# Altium schematic sheet ltk-mw.SchDoc
size A3; Organization: Altium Limited; Address1: L3, 12a Rodborough Rd; Address2: Frenchs Forest; Address3: NSW; Address4: Australia 2086
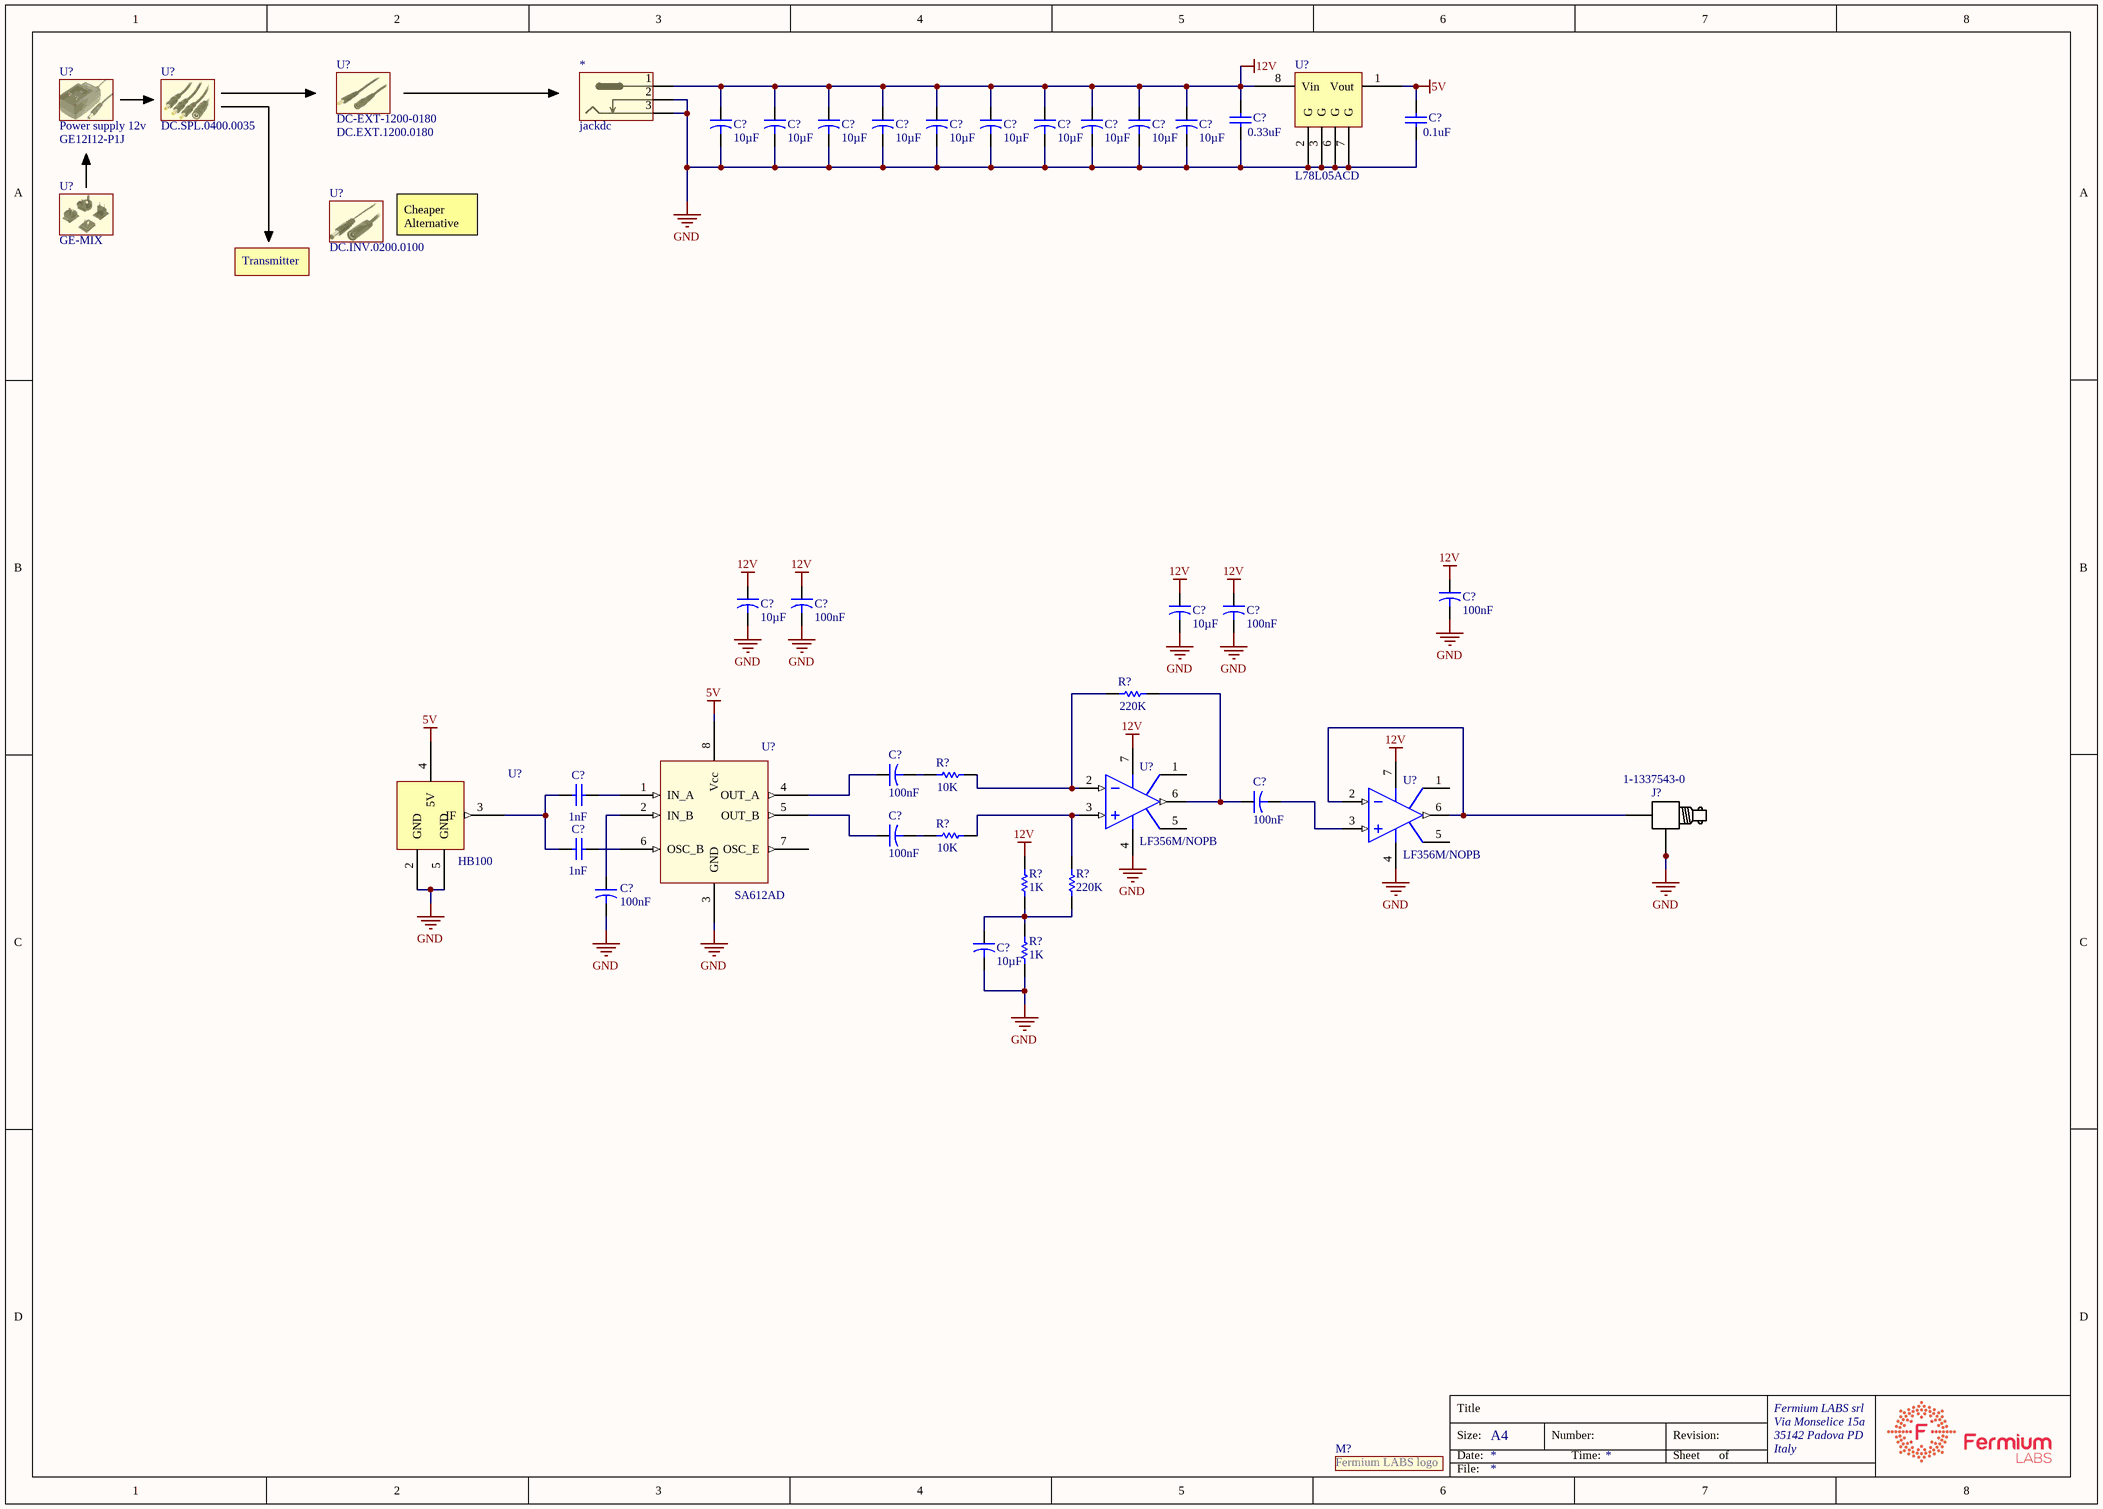
[diagram p0: ltk-mw.SchDoc]

## Parts
(Parts that share a designator on the sheet are numbered #1, #2 ... from top to bottom, then left to right.)
*  jackdc  [dc-jack]
C?#1  Capacitance: 10µF  [CAP 1206/3216]
C?#2  Capacitance: 10µF  [CAP 1206/3216]
C?#3  Capacitance: 10µF  [CAP 1206/3216]
C?#4  Capacitance: 10µF  [CAP 1206/3216]
C?#5  Capacitance: 10µF  [CAP 1206/3216]
C?#6  Capacitance: 10µF  [CAP 1206/3216]
C?#7  Capacitance: 10µF  [CAP 1206/3216]
C?#8  Capacitance: 10µF  [CAP 1206/3216]
C?#9  Capacitance: 10µF  [CAP 1206/3216]
C?#10  Capacitance: 10µF  [CAP 1206/3216]
C?#11  value 0.33uF  [RAD-0.3]
C?#12  value 0.1uF  [RAD-0.3]
C?#13  Capacitance: 100nF  [CAP 0805/2012]
C?#14  Capacitance: 10µF  [CAP 1206/3216]
C?#15  Capacitance: 100nF  [CAP 0805/2012]
C?#16  Capacitance: 10µF  [CAP 1206/3216]
C?#17  Capacitance: 100nF  [CAP 0805/2012]
C?#18  value 1nF  [CAP 0805/2012]
C?#19  Capacitance: 100nF  [CAP 0805/2012]
C?#20  Capacitance: 100nF  [CAP 0805/2012]
C?#21  value 1nF  [CAP 0805/2012]
C?#22  Capacitance: 100nF  [CAP 0805/2012]
C?#23  Capacitance: 100nF  [CAP 0805/2012]
C?#24  Capacitance: 10µF  [CAP 1206/3216]
J?  Supplier Part Number 1: 1-1337543-0  [BNC-RA]
M?  fermiumlabs-logo  [frm-small]  (value not drawn)
R?#1  value 220K  [AXIAL-0.3]  (hidden comment: Res1)
R?#2  value 10K  [AXIAL-0.3]  (hidden comment: Res1)
R?#3  value 10K  [AXIAL-0.3]  (hidden comment: Res1)
R?#4  value 1K  [AXIAL-0.3]  (hidden comment: Res1)
R?#5  value 220K  [AXIAL-0.3]  (hidden comment: Res1)
R?#6  value 1K  [AXIAL-0.3]  (hidden comment: Res1)
U?#1  DC-EXT-1200-0180  Supplier Part Number 1: DC.EXT.1200.0180  (mechanical)
U?#2  Power supply 12v  (mechanical)
U?#3  DC.SPL.0400.0035  (mechanical)
U?#4  L78L05ACD  [ST SOIC-8N]
U?#5  Worldwide plugs for power supply  (value not drawn)  (mechanical)
U?#6  (no value)  (mechanical)
U?#7  Supplier Part Number 3: LF356M/NOPB  [TI SOIC-8 D]  (hidden comment: U*)
U?#8  Supplier Part Number 3: LF356M/NOPB  [TI SOIC-8 D]  (hidden comment: U*)
U?#9  HB100  [HB100]
U?#10  Supplier Part Number 1: SA612AD  [TI SOIC-8 D]  (hidden comment: SA612A)

## Nets
5V: C?#12.2 U?#4.1(Vout) U?#9.4(5V) U?#10.8(Vcc)
12V: *.1 C?#1.1 C?#2.1 C?#3.1 C?#4.1 C?#5.1 C?#6.1 C?#7.1 C?#8.1 C?#9.1 C?#10.1 C?#11.2 C?#13.1 C?#14.1 C?#15.1 C?#16.1 C?#17.1 R?#4.2 U?#4.8(Vin) U?#7.7(VDD+) U?#8.7(VDD+)
GND: *.2 *.3 C?#1.2 C?#2.2 C?#3.2 C?#4.2 C?#5.2 C?#6.2 C?#7.2 C?#8.2 C?#9.2 C?#10.2 C?#11.1 C?#12.1 C?#13.2 C?#14.2 C?#15.2 C?#16.2 C?#17.2 C?#23.2 C?#24.2 J?.2(gnd) J?.A J?.B R?#6.1 U?#4.2(G) U?#4.3(G) U?#4.6(G) U?#4.7(G) U?#7.4(VDD-) U?#8.4(VDD-) U?#9.2(GND) U?#9.5(GND) U?#10.3(GND)
NetC?#18_1: C?#18.1 C?#21.1 U?#9.3(IF)
NetC?#18_2: C?#18.2 U?#10.1(IN_A)
NetC?#19_1: C?#19.1 U?#10.4(OUT_A)
NetC?#19_2: C?#19.2 R?#2.1
NetC?#20_1: C?#20.1 R?#1.2 U?#7.6(OUT)
NetC?#20_2: C?#20.2 U?#8.3(IN+)
NetC?#21_2: C?#21.2 U?#10.6(OSC_B)
NetC?#22_1: C?#22.1 U?#10.5(OUT_B)
NetC?#22_2: C?#22.2 R?#3.1
NetC?#23_1: C?#23.1 U?#10.2(IN_B)
NetC?#24_1: C?#24.1 R?#4.1 R?#5.1 R?#6.2
NetJ?_1: J?.1 U?#8.2(IN-) U?#8.6(OUT)
NetR?#1_1: R?#1.1 R?#2.2 U?#7.2(IN-)
NetR?#3_2: R?#3.2 R?#5.2 U?#7.3(IN+)

Not connected (* = marked no-connect by the designer): U?#7 1(CXA) 5; U?#8 1(CXA) 5; U?#10 7(OSC_E)

## Notes on the sheet
- Cheaper
  Alternative
- (near U?#6) Transmitter
- Title
- Size:
- Date:
- A4
- Number:
- Time:
- Revision:
- Sheet
- of
- Fermium LABS srl
- Via Monselice 15a
- 35142 Padova PD
- Italy
- File:
- (in symbol fermiumlabs-logo) Fermium LABS logo

## Library data of the parts
C?#1-C?#10 C?#14 C?#16 C?#24 = Cap2: Capacitor; Manufacturer: SAMSUNG; Manufacturer Part Number: CL31A106KAHNNNE; Unit: pcs; SuppliedAmount: 0; MinAmount: 100; Capacitor type: ceramic; Capacitor kind: MLCC; Operating voltage: 25V; Dielectric: X5R; Tolerance: ±10%; Case - inch: 1206; Case - mm: 3216; Pads: 2 SMD; Published: 23-Sep-2002; PackageReference: CAPR5-4X5; Publisher: Altium Limited; PackageDescription: 1206; Supplier 1: TME; Supplier Part Number 1: CL31A106KAHNNNE; Category: 1206 MLCC SMD Capacitors; Stock 1: 279700; Pricing 1: 100=0.0248, 300=0.0203, 1000=0.0167, 2000=0.0131, 10000=0.0127 (EUR); Weight: 0.061; Multiples: 100; Mounting: SMD; Operating temperature: -55...85°C; Price Type: NET; ComponentLink1URL: http://static.tme.eu/products_pics/b/e/9/be9e0dd298dcf4979ea1dd3d226e0bfa/58780.jpg; ComponentLink1Description: http://static.tme.eu/products_pics/b/e/9/be9e0dd298dcf4979ea1dd3d226e0bfa/58780.jpg
C?#11 C?#12 C?#18 C?#21 = Cap: Capacitor; Published: 8-Jun-2000; LatestRevisionDate: 17-Jul-2002; LatestRevisionNote: Re-released for DXP Platform.; PackageReference: RAD-0.3; Publisher: Altium Limited; PackageDescription: Radial Cap, Thru-Hole; 2 Leads; 0.3 in Pin Spacing
C?#13 C?#15 C?#17 C?#19 C?#20 C?#22 C?#23 = Cap2: Capacitor; Manufacturer: YAGEO; Manufacturer Part Number: CC0805JRX7R9BB104; Unit: pcs; SuppliedAmount: 0; MinAmount: 100; Capacitor type: ceramic; Capacitor kind: MLCC; Operating voltage: 50V; Dielectric: X7R; Tolerance: ±5%; Case - inch: 0805; Case - mm: 2012; Pads: 2 SMD; Supplier 1: TME; Supplier Part Number 1: CC0805JRX7R9104; Category: 0805 MLCC SMD Capacitors; Stock 1: 89911; Pricing 1: 100=0.00613, 300=0.00464, 1000=0.00342, 4000=0.00284, 20000=0.00273 (EUR); Weight: 0.042; Multiples: 100; Mounting: SMD; Price Type: NET; ComponentLink1URL: http://static.tme.eu/products_pics/d/b/b/dbbd93eaf25225110ca26eb66da77328/58538.jpg; ComponentLink1Description: http://static.tme.eu/products_pics/d/b/b/dbbd93eaf25225110ca26eb66da77328/58538.jpg
J? = BNC-PCB-RA: connector bnc; Manufacturer: TE CONNECTIVITY; Unit: pcs; SuppliedAmount: 0; MinAmount: 1; Connector: socket; Connector variant: insulated; Spatial orientation: angled 90°; Wave impedance: 50Ω; Electrical mounting: THT; Mechanical mounting: on PCBs; Insulator material: polyester; Pads: 4 THT; Supplier 1: TME; Manufacturer Part Number: 1-1337543-0; Category: BNC connectors; Stock 1: 44; Pricing 1: 1=1.22, 25=1.1, 100=0.98, 1000=0.86 (EUR); Weight: 13.22; Multiples: 1; Connector type: BNC; Contact plating: gold plated; Price Type: NET; ComponentLink1URL: http://static.tme.eu/products_pics/6/3/2/63240353f8a8790dbe8f7bd93b014c1a/378606.jpg; ComponentLink1Description: http://static.tme.eu/products_pics/6/3/2/63240353f8a8790dbe8f7bd93b014c1a/378606.jpg
R?#1 R?#5 = Res1: Resistor; Manufacturer: Royal Electronic Factory; Manufacturer Part Number: 0805S8J0224T5E; Supplier 1: TME; Supplier Part Number 1: SMD0805-220K; Stock 1: 102100; Pricing 1: 100=0.0065, 1000=0.0025, 5000=0.0009, 15000=0.0008, 50000=0.0008 (USD)
R?#2 R?#3 = Res1: Resistor; Published: 8-Jun-2000; LatestRevisionDate: 17-Jul-2002; LatestRevisionNote: Re-released for DXP Platform.; PackageReference: AXIAL-0.3; Publisher: Altium Limited; PackageDescription: Axial Device, Thru-Hole; 2 Leads; 0.3 in Pin Spacing
R?#4 R?#6 = Res1: Resistor; Manufacturer: Royal Electronic Factory; Manufacturer Part Number: 0805S8J0102T5E; Supplier 1: TME; Supplier Part Number 1: SMD0805-1K; Stock 1: 2713700; Pricing 1: 100=0.0062, 1000=0.0024, 5000=0.0008, 15000=0.0008, 50000=0.0008 (USD)
U?#2 = GE12I12-P1J: Supplier 1: TME; Supplier Part Number 1: GE12I12-P1J
U?#5 = GE-MIX: Supplier 1: TME; Supplier Part Number 1: GE-MIX
U?#6 = DC.INV.0200.0100: Supplier 1: TME; Supplier Part Number 1: DC.INV.0200.0100
U?#7 U?#8 = LF358: Supplier 1: Farnell; Supplier 2: Mouser; Supplier 3: TME; Supplier Part Number 1: 1149979; Supplier Part Number 2: 926-LF356M/NOPB
U?#9 = HB100: Manufacturer: China unspecified; Manufacturer Part Number: HB100; Supplier 1: Alibaba; Supplier Part Number 1: HB100
U?#1 = DC-EXT-1200-0180: Supplier 1: TME
U?#3 = DC.SPL.0400.0035: Supplier 1: TME; Supplier Part Number 1: DC.SPL.0400.0035
U?#4 = L78L05ACD: Supplier 1: TME; Supplier Part Number 1: L78L05ACD
U?#10 = SA612A: Supplier 1: TME; Supplier 2: Mouser; Supplier Part Number 2: 771-SA612AD01112